# Altium schematic sheet ams.SchDoc: ams-master
size A4; Date: 05.10.2017; CheckedBy: UNCHECKED; Author: Leon Loeser; Organization: Baltic Racing; Address1: Zur Schwedenschanze 15; Address2: Haus 18; Address3: 18435 Stralsund; Revision: xx.xx; SheetNumber: 2; SheetTotal: 9; Rules: EV5.8; ProjectName: Projekt
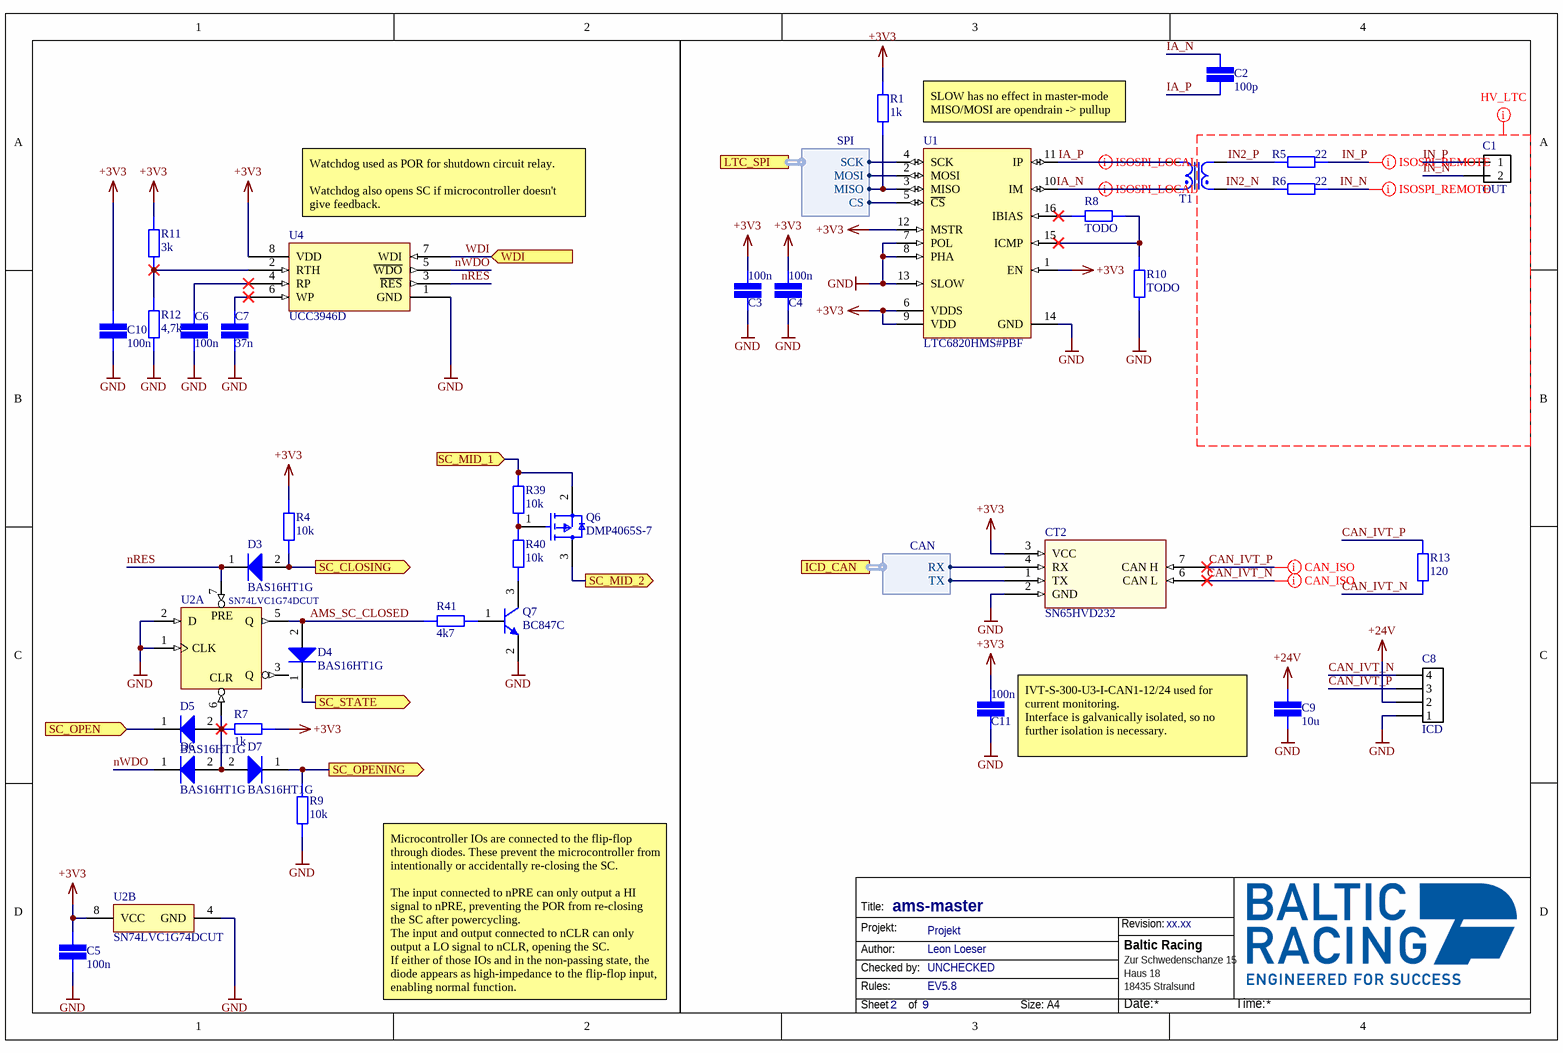
[diagram p0: ams.SchDoc]

## Parts
C1  OUT  [43045-0212]
C2  value 100p  [CAP 0603/1608]  (hidden comment: SMD Capacitor)
C3  value 100n  [CAP 0603/1608]  (hidden comment: SMD Capacitor)
C4  value 100n  [CAP 0603/1608]  (hidden comment: SMD Capacitor)
C5  value 100n  [CAP 0603/1608]  (hidden comment: SMD Capacitor)
C6  value 100n  [CAP 0603/1608]  (hidden comment: SMD Capacitor)
C7  value 37n  [CAP 0603/1608]  (hidden comment: SMD Capacitor)
C8  ICD  [43045-0412]
C9  value 10u  [CAP 1206/3216]  (hidden comment: SMD Capacitor)
C10  value 100n  [CAP 0603/1608]  (hidden comment: SMD Capacitor)
C11  value 100n  [CAP 0603/1608]  (hidden comment: SMD Capacitor)
CT2  SN65HVD232  [SOIC8 CAN-Transceiver]
D3  BAS16HT1G  [ONSC-SOD-323-2-477-02_V]
D4  BAS16HT1G  [ONSC-SOD-323-2-477-02_V]
D5  BAS16HT1G  [ONSC-SOD-323-2-477-02_V]
D6  BAS16HT1G  [ONSC-SOD-323-2-477-02_V]
D7  BAS16HT1G  [ONSC-SOD-323-2-477-02_V]
Q6  DMP4065S-7  [FP-SOT23-MFG]
Q7  BC847C  [INF-SOT23_L]
R1  value 1k  [STACKPOLE CSR0603]  (hidden comment: SMD Resistor)
R4  value 10k  [STACKPOLE CSR0603]  (hidden comment: SMD Resistor)
R5  value 22  [STACKPOLE CSR0603]  (hidden comment: SMD Resistor)
R6  value 22  [STACKPOLE CSR0603]  (hidden comment: SMD Resistor)
R7  value 1k  [STACKPOLE CSR0603]  (hidden comment: SMD Resistor)
R8  value TODO  [STACKPOLE CSR0603]  (hidden comment: SMD Resistor)
R9  value 10k  [STACKPOLE CSR0603]  (hidden comment: SMD Resistor)
R10  value TODO  [STACKPOLE CSR0603]  (hidden comment: SMD Resistor)
R11  value 3k  [STACKPOLE CSR0603]  (hidden comment: SMD Resistor)
R12  value 4,7k  [STACKPOLE CSR0603]  (hidden comment: SMD Resistor)
R13  value 120  [STACKPOLE CSR0603]  (hidden comment: SMD Resistor)
R39  value 10k  [STACKPOLE CSR0603]  (hidden comment: SMD Resistor)
R40  value 10k  [STACKPOLE CSR0603]  (hidden comment: SMD Resistor)
R41  value 4k7  [STACKPOLE CSR0603]  (hidden comment: SMD Resistor)
T1  750110055  [Wuerth_750110055]  (value not drawn)
U1  LTC6820HMS#PBF  [LT-MS-16_M]
U2  SN74LVC1G74DCUT  [DCU0008A_L]  (parts A,B of 2)
U4  UCC3946D  [SOIC8]

## Ports
ICD_CAN (harness CAN), LTC_SPI (harness SPI), SC_CLOSING (out), SC_MID_1 (in), SC_MID_2 (out), SC_OPEN (in), SC_OPENING (out), SC_STATE (out), WDI (in)

## Harnesses
SPI: SCK, MOSI, MISO, CS
CAN: TX, RX

## Nets
+3V3: C3.1 C4.1 C5.1 C10.2 C11.1 CT2.3(VCC) R1.2 R4.1 R7.2 R11.1 U1.1(EN) U1.6(VDDS) U1.9(VDD) U1.12(MSTR) U2.8(VCC) U4.8(VDD)
+24V: C8.2 C9.2
GND: C3.2 C4.2 C5.2 C6.1 C7.1 C8.1 C9.1 C10.1 C11.2 CT2.2(GND) Q7.2(E) R9.2 R10.1 R12.2 U1.7(POL) U1.8(PHA) U1.13(SLOW) U1.14(GND) U2.1(CLK) U2.2(D) U2.4(GND) U4.1(GND)
AMS_SC_CLOSED: D4.2(A) R41.2 U2.5(Q)
CAN_IVT_N: C8.4 CT2.6(CAN_L) R13.1
CAN_IVT_P: C8.3 CT2.7(CAN_H) R13.2
IA_N: C2.2 T1.1 U1.10(IM)
IA_P: C2.1 T1.2 U1.11(IP)
IN2_N: R6.1 T1.4
IN2_P: R5.1 T1.3
IN_N: C1.2 R6.2
IN_P: C1.1 R5.2
nRES: D3.1(K) U2.7(~{PRE}) U4.3(~{RES})
nWDO: D6.1(K) U4.5(~{WDO})
SC_CLOSING: D3.2(A) R4.2 ; port SC_CLOSING
SC_MID_1: Q6.2(S) R39.1 ; port SC_MID_1
SC_MID_2: Q6.3(D) ; port SC_MID_2
SC_OPEN: D5.1(K) ; port SC_OPEN
SC_OPENING: D7.1(K) R9.1 ; port SC_OPENING
SC_STATE: D4.1(K) ; port SC_STATE
WDI: U4.7(WDI) ; port WDI
NetC6_2: C6.2 U4.4(RP)
NetC7_2: C7.2 U4.6(WP)
NetCT2_1: CT2.1(TX) ; port ICD_CAN.TX
NetCT2_4: CT2.4(RX) ; port ICD_CAN.RX
NetD5_2: D5.2(A) D6.2(A) D7.2(A) R7.1 U2.6(~{CLR})
NetQ6_1: Q6.1(G) R39.2 R40.1
NetQ7_1: Q7.1(B) R41.1
NetQ7_3: Q7.3(C) R40.2
NetR1_1: R1.1 U1.3(MISO) ; port LTC_SPI.MISO
NetR8_1: R8.1 R10.2 U1.15(ICMP)
NetR8_2: R8.2 U1.16(IBIAS)
NetR11_2: R11.2 R12.1 U4.2(RTH)
NetU1_2: U1.2(MOSI) ; port LTC_SPI.MOSI
NetU1_4: U1.4(SCK) ; port LTC_SPI.SCK
NetU1_5: U1.5(~{CS}) ; port LTC_SPI.CS

Not connected (* = marked no-connect by the designer): CT2 5(NC) 8(NC); U2 3(Q)

## Layout directives
differential pair: CAN_IVT_N, CAN_IVT_P, IA_N, IA_P, IN_N, IN_P
net class HV_LTC: IN2_N, IN2_P, IN_N, IN_P

## Notes on the sheet
- SLOW has no effect in master-mode
  MISO/MOSI are opendrain -> pullup
- (near U4) Watchdog used as POR for shutdown circuit relay.
  Watchdog also opens SC if microcontroller doesn't give feedback.
- IVT-S-300-U3-I-CAN1-12/24 used for current monitoring.
  Interface is galvanically isolated, so no further isolation is necessary.
- Microcontroller IOs are connected to the flip-flop through diodes. These prevent the microcontroller from intentionally or accidentally re-closing the SC.
  The input connected to nPRE can only output a HI signal to nPRE, preventing the POR from re-closing the SC after powercycling.
  The input and output connected to nCLR can only output a LO signal to nCLR, opening the SC.
  If either of those IOs and in the non-passing state, the diode appears as high-impedance to the flip-flop input, enabling normal function.
- Title:
- Projekt:
- Revision:
- Author:
- Rules:
- Checked by:
- Sheet
- of
- Size:
- A4
- Date:
- Time:
- (in symbol CMP-0859-00687-1, part A) PRE; CLR

## Library data of the parts
C1 = MicroFit3.0 2-Pin: Molex MicroFit3.0 2-Pin
C2-C7 C10 = SMD Capacitor: Capacitor with multiple Footprints; Voltage: 6.3V
C8 = MicroFit3.0 4-Pin: Molex Micro-Fit 3.0 4-Pin / 600V / 8.5V
C9 C11 = SMD Capacitor: Capacitor with multiple Footprints
CT2 = SN65HVD232: Standard CAN-Transciever 3.3V
D3-D7 = CMP-1054-00068-1: Switching Diode, 2-Pin SOD-323, Pb-Free, Tape and Reel; Manufacturer: On Semiconductor; Configuration: Single; IF Max (A): 0.2; trr Max (ns): 6; Packing: Tape and Reel; ComponentLink2URL: http://www.onsemi.com/pub_link/Collateral/BAS16HT1-D.PDF; ComponentLink3Description: Package Specification; RoHS: TRUE; PackageDescription: 2-Pin SOD, Body 1.7 x 1.25 mm; PackageReference: SOD-323-2-477-02; PartNumber: BAS16HT1G; ComponentLink1URL: http://www.onsemi.com/; Mounting Technology: Surface Mount; ComponentLink1Description: Manufacturer URL; ComponentLink2Description: Datasheet; DatasheetVersion: Rev. 11; PackageVersion: Rev. H, 03/2007; ComponentLink3URL: http://www.onsemi.com/pub_link/Collateral/477-02.PDF.1
Q6 = CMP-12801-000050-1: MOSFET P-CH 40V 2.4A SOT23; Manufacturer: Diodes Inc.; Number Of Channels: 1; Max Junction Temp: +150°C; Standoff Height: 0.013mm; Power Dissipation: 0.72W; Turn Off Delay Time: 36.3ns; Rthja Max: 171°C/W; Typ Forward Diode Voltage: -0.7V; Max Forward Diode Voltage: -1.2V; Drain To Source Voltage: -40V; Threshold Vgs Min: -1V; Gate To Source Voltage: 20V; Depletion Mode: False; Input Capacitace At Vds: 587pF @ -20V; Drain To Source Resistance: 64mΩ; Turn On Delay Time: 3.6ns; Continuous Drain Current: -2.4A; Pulse Drain Current: -20A; Gate Charge At Vgs: 12.2nC @ -10V; Threshold Vgs Max: -3V; Octopart: https://octopart.com/dmp4065s-7-diodes+inc.-57605044; Footprint Url: https://www.diodes.com/assets/Package-Files/SOT23.pdf; Device Class L2: Transistors; Package: SOT23; Number Of P Channels: 1; ComponentLink2URL: https://www.diodes.com/assets/Datasheets/DMP4065S.pdf; Temperature Range High: +150°C; Device Class L1: Discrete Semiconductors; Temperature Range Low: -55°C; Manufacturer Part Number: DMP4065S-7; ComponentLink2Description: Datasheet; Lead Free: Yes; Temperature: -55°C to +150°C; Drain To Source Breakdown Voltage: -40V; Category: Trans; Height: 1.1mm; Digikey Description: MOSFET P-CH 40V 2.4A SOT23; Ipc Land Pattern Name: SOT92P240X102-3; Device Class L3: MOSFETs; RoHS: TRUE; Mouser Description: Trans MOSFET P-CH 40V 2.4A Automotive 3-Pin SOT-23 T/R; Automotive: No
Q7 = CMP-1177-00037-1: NPN Silicon AF Transistor, 45 V VCEO, 100 mA IC, SOT23, Reel, Green; Manufacturer: Infineon; VCEO (max): 45Â V; VEBO (max): 6Â V; fT (typ): 250Â MHz; VCBO (max): 50Â V; ICM (max): 200Â mA; Green: TRUE; IC (max): 100Â mA; Ptot (max): 330Â mW; ICBO (max): 15Â nA; PartNumber: BC847C; ComponentLink3URL: http://www.infineon.com/dgdl/SOT23-Package_Overview.pdf?folderId=db3a30431936bc4b0119532290053c66&fileId=db3a30431936bc4b0119533468123c85; ComponentLink3Description: Package Specification; Mounting Technology: Surface Mount; PackageDescription: 3-Pin Small Outline Transistor Package, 1.3 x 2.9 mm Body, 0.95 mm Pitch; PackageReference: SOT23; ComponentLink2URL: http://www.infineon.com/dgdl/bc847series_bc848series_bc849series_bc850series.pdf?folderId=db3a304314dca389011541d30fa21656&fileId=db3a304314dca389011541d4630a1657; ComponentLink2Description: Datasheet; ComponentLink1Description: Manufacturer URL; Polarity: NPN; ComponentLink1URL: http://www.infineon.com/; IBM (max): 200Â mA; Packing: Reel; PackageVersion: Apr-08
R1 R4-R13 R39-R41 = SMD Resistor: Resistor with multiple footprints
T1 = Wuerth_Transformer_750110055: Würth Toroid Transformer 1:1 70µH; Order Nr.: 750312504; Hersteller: Würth
U1 = CMP-0937-00009-1: IsoSPI Isolated Communication Interface, 2.7 to 5.5 V, -40 to 125 degC, 16-Pin MSOP (MS), Pb-Free; Manufacturer: Linear Technology; IO Supply Current: 1 uA Max.; IO Supply Voltage Range: 1.7 to 5.5 V; Receiver Input Resistance: 35 kOhm; VBIAS: 1.9 to 2.1 V; Supply Current, IDLE State: 2 uA; ComponentLink3Description: Package Specification; Mounting Technology: Surface Mount; ComponentLink2URL: http://cds.linear.com/docs/en/datasheet/6820fa.pdf; PackageVersion: Rev. A; PackageReference: MS-16; PackageDescription: 16-Pin Micro Small Outline Package, Body 4.039 x 3 mm, Pitch 0.5 mm; ComponentLink3URL: http://cds.linear.com/docs/en/packaging/05081669_A_MS16.pdf; DatasheetVersion: Rev. A; Power Supply: 2.7 to 5.5 V; ComponentLink1Description: Manufacturer URL; PartNumber: LTC6820HMS#PBF; Temperature Range (degC): -40 to 125; ComponentLink1URL: http://www.linear.com/; ComponentLink2Description: Datasheet
U2 = CMP-0859-00687-1: Single Positive-Edge-Triggered D-Type Flip-Flop With Clear and Preset, DCU0008A, SMALL T&R; Schmitt Trigger: No; Technology Family: LVC; VCC(Min)(V): 1.65; F @ Nom Voltage(Max)(Mhz): 150; ICC @ Nom Voltage(Max)(mA): 0.01; Voltage(Nom)(V): 1.8,2.5,3.3,5; VCC(Max)(V): 5.5; Output Type: CMOS; Logic: True; tpd @ Nom Voltage(Max)(ns): 13.4,7.1,5.9,4.1; Input Type: CMOS/TTL; Output Drive (IOL/IOH)(Max)(mA): 32/-32; Rating: Catalog; Bits(#): 1; Operating Temperature Range(C): -40 to 125; PackageReference: DCU0008A; ComponentLink2Description: Datasheet; DatasheetVersion: SCES794E; Part Number: SN74LVC1G74; Sub-Family: D-Type Flip-Flop; ComponentLink1URL: http://www.ti.com/; PartNumber: SN74LVC1G74DCUT; ComponentLink2URL: http://www.ti.com/lit/ds/symlink/sn74lvc1g74.pdf; ComponentLink1Description: Manufacturer URL; 3-State Output: No
U4 = UCC3946: Microprocessor supervisor with watchdog timer